# Altium project BTM_MAIN_UNIT.PrjPcb (part 3 of 3)

## Sheet 12V_TO_5V_DC.SchDoc
size A; SheetNumber: 28; SheetTotal: 28
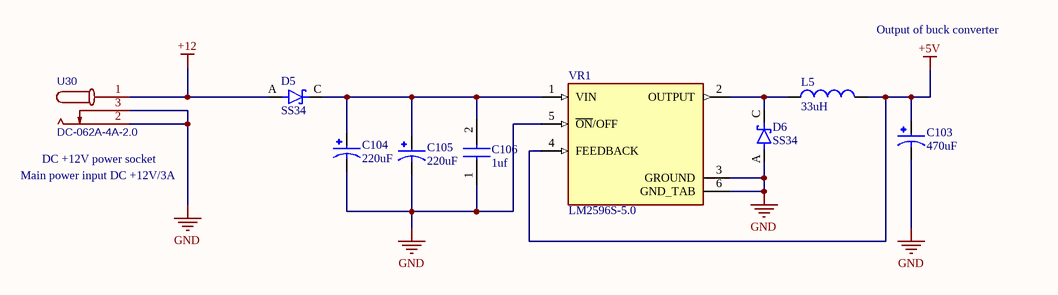
[diagram p28: 12V_TO_5V_DC.SchDoc]

### Parts
C103  470uF  [Plugin,6.3x8mm]
C104  220uF  [Plugin,6.3x8mm]
C105  220uF  [Plugin,6.3x8mm]
C106  1uf  [C0805]
D5  SS34  [SMA]
D6  SS34  [SMA]
L5  33uH  [Inductor]
U30  DC-062A-4A-2.0  [Plugin]
VR1  LM2596S-5.0  [TO-263-5]

### Nets
+5V: C103.1 L5.2 VR1.4(FEEDBACK)  [project net VBUS2]
+12: D5.A U30.1
GND: C103.2 C104.2 C105.2 C106.1(C1) D6.A U30.2 U30.3 VR1.3(GROUND) VR1.5(~{ON}/OFF) VR1.6(GND_TAB)
NetC104_1: C104.1 C105.1 C106.2(C2) D5.C(K) VR1.1(VIN)
NetD6_C: D6.C(K) L5.1 VR1.2(OUTPUT)

### Notes on the sheet
- Output of buck converter
- (near U30) Main power input DC +12V/3A
- (near U30) DC +12V power socket

### Library data of the parts
C103 = SPTOJM471E08OR: 6.3V 470uF ±20% Plugin,6.3x8mm Solid Capacitors ROHS; MPN: EEE-HC1H101P; Manufacturer: Panasonic; Package Reference: RADIAL-2 Panasonic; Value: *
C104 C105 = SPZ1CM221E08O00RAXXX: 16V 220uF ±20% 20mΩ@100kHz 2.7A@100kHz Plugin,6.3x8mm Solid Capacitors ROHS; MPN: EEE-HC1H101P; Manufacturer: Panasonic; Package Reference: RADIAL-2 Panasonic; Value: *
C106 = CL21B105KBFNNNE: 50V 1uF X7R ±10% 0805 Multilayer Ceramic Capacitors MLCC - SMD/SMT ROHS; Manufacturer: KEMET; MPN: CC0603JRNPO9BN180
D5 D6 = SS34: Diode Schottky 40V 3A 2-Pin SMC T/R; Value: *
  D5: Price: None; MP: SS34; Availability: Unavailable; Package: None
  D6: MPN: SS34; Package Reference: None
L5 = SLH1207S330MTT: 3A 33uH ±20% 64.8mΩ SMD Power Inductors ROHS; MPN: AIML-0805HC-100M-T; Manufacturer: Abracon; Package Reference: 2012 Abracon; Value: *
VR1 = LM2596S-5.0: Step-down type Fixed 40V~40V 5V 3A TO-263-5 DC-DC Converters ROHS; Value: *; Package Reference: None; MPN: LM2596S-5.0
U30 = DC-062A-4A-2.0: LCSC: C5147479; MPN: DC-062A-4A-2.0

## Sheet Display_PWR_CTRL.SchDoc
size A; SheetNumber: 21; SheetTotal: 30
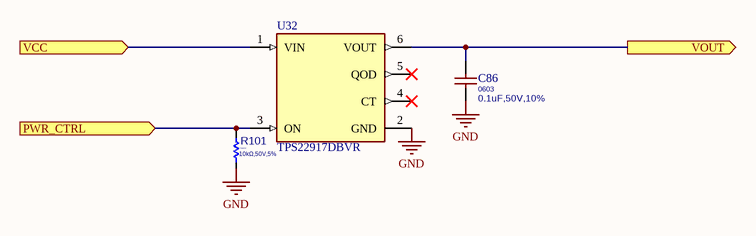
[diagram p29: Display_PWR_CTRL.SchDoc]

### Parts
C86  Package: 0603  [C0603]  (hidden comment: 0.1uF,50V,10%)
R101  value 10kΩ,50V,5%  Package: 0402  [R0402]  (hidden comment: 10kΩ)
U32  TPS22917DBVR  [SOT95P280X145-6N]

### Ports
PWR_CTRL (in), VCC (in), VOUT (out)

### Nets
GND: C86.1 R101.1 U32.2(GND)
NetC86_2: C86.2 U32.6(VOUT) ; port VOUT
NetR101_2: R101.2 U32.3(ON) ; port PWR_CTRL
NetU32_1: U32.1(VIN) ; port VCC

Not connected (* = marked no-connect by the designer): U32 4(CT)* 5(QOD)*

### Library data of the parts
C86 = GCM188R71H104KA57J: CAP CER 0.1UF 50V X7R 0603; Manufacturer: Murata Electronics; Type: SM; Min Operating Temp: -55°C; Max Operating Temp: 125°C; MPN: GCM188R71H104KA57J; Datasheet: https://datasheet.lcsc.com/lcsc/2404081050_Murata-Electronics-GCM188R71H104KA57J_C3011652.pdf; LCSC: C3011652; Value: 0.1uF,50V,10%
R101 = RC0402JR-0710KL: as R31-R33 on sheet ETHERNET_STM32; MPN: RC0402JR-0710KL; Max Operating Temp: +155; Min Operating Temp: -55; Datasheet: https://datasheet.lcsc.com/lcsc/1810241334_YAGEO-RC0402JR-0710KL_C60489.pdf; LCSC: C60489
U32 = TPS22917DBVR: 5.5-V, 2-A, 80-mÎ© , 10-nA leakage load switch adj. rise time and adj output discharge; MF: Texas Instruments; SnapEDA_Link: https://www.snapeda.com/parts/TPS22917DBVR/Texas+Instruments/view-part/?ref=snap; Package: SOT-23-6 Texas Instruments; Value: *; MP: TPS22917DBVR; Check_prices: https://www.snapeda.com/parts/TPS22917DBVR/Texas+Instruments/view-part/?ref=eda

## Nets that join several sheets
3V3: ETHERNET_STM32 (U4.1), NRF52 (9 pins)
+3.3V: Hierarchical schematics design (D3.C D7.C), MAX31865ATP (16 pins), BQ24259RGER (7 pins), SD card (7 pins), INPUT (R55.2 R56.2), STM32F446RET6 (16 pins), SIM7600G-H (U21.7), ESP8266 MODULE (R99.2 R100.2 U31.2), Humidity (R104.2), USER_INTERFACE_input (J3.9), BATTERY SOC (U25.3), ESP8266_PWR_CTRL (U33.1), ETHERNET_STM32 (7 pins)
+3.3V_LDO: Hierarchical schematics design (D3.A), 5v to 3.3V LDO (C101.1 U28.5)
+4.2V: PWR_CTRL (C48.2 U13.6), 3.4_4.2V_TO_FIXED_3.3V (C36.2 R59.2 U10.5), BUZZER (U34.1), SIM7600G-H_PWR_CTRL (U29.1), BOOST_CONVERTER (B1.5 C31.2 L6.1)
+12V: INPUT (U9.1), BOOST_CONVERTER (5 pins)
BAT: PWR_CTRL (C47.2 U12.6 U13.1), BQ24259RGER (5 pins)
GND: MAX31865ATP (24 pins), PWR_CTRL (6 pins), BQ24259RGER (16 pins), SD card (6 pins), POWER SUPPLY (C32.2 C33.1 D1.2 T1.6), INPUT (9 pins), STM32F446RET6 (28 pins), USB (7 pins), 3.4_4.2V_TO_FIXED_3.3V (7 pins), SIM7600G-H (63 pins), SIM_INTERFACE (10 pins), BUZZER (C111.1 LS1.N R83.1 U34.2), ESP8266 MODULE (U24.1 U31.4), Humidity (C87.1 C88.1 U26.5), USER_INTERFACE_input (J3.1), SIM7600G-H_PWR_CTRL (C102.1 R108.1 U29.2), BATTERY SOC (5 pins), ESP8266_PWR_CTRL (C107.1 R102.1 U33.2), BOOST_CONVERTER (6 pins), 5v to 3.3V LDO (C100.2 C101.2 U28.2), FLASH MEMORY (C2.1 U1.4), ETHERNET_W5500 (38 pins), ETHERNET_STM32 (11 pins), RS485 (1.5 R54.1 U6.2), SIM7600G-H_USB (8 pins), NRF52 (18 pins), 12V_TO_5V_DC (10 pins), Display_PWR_CTRL (C86.1 R101.1 U32.2)
USIM_VDD: SIM7600G-H (U22.20), SIM_INTERFACE (C81.2 CR1.1 J8.1)
VBAT: SIM7600G-H (9 pins), SIM7600G-H_PWR_CTRL (FB3.1)
VBUS2: BQ24259RGER (C38.2 U11.1 U11.24), POWER SUPPLY (C32.1 C33.2 D1.1 T1.4), RS485 (5 pins), 12V_TO_5V_DC (C103.1 L5.2 VR1.4)
VUSB: USB (USB1.2 USB1.11), 5v to 3.3V LDO (C100.1 U28.1 U28.3)
BAT+: BQ24259RGER (C44.2 J2.1 U11.13 U11.14), BATTERY SOC (C85.2 U25.2)
BOOST_COV_ON/OFF: STM32F446RET6 (U20.57), BOOST_CONVERTER (B1.4 R82.1)
BUTTON_1: STM32F446RET6 (U20.53), USER_INTERFACE_input (J3.4)
BUTTON_2: STM32F446RET6 (U20.2), USER_INTERFACE_input (J3.5)
BUTTON_3: STM32F446RET6 (U20.55), USER_INTERFACE_input (J3.6)
BUTTON_4: STM32F446RET6 (U20.56), USER_INTERFACE_input (J3.7)
BUZZER: STM32F446RET6 (U20.20), BUZZER (R83.2 U34.3)
CHARGE_STATUS: BQ24259RGER (R60.1 U11.4), STM32F446RET6 (U20.14)
CS: STM32F446RET6 (U20.11), USER_INTERFACE_input (J3.14)
CS_1: MAX31865ATP (U15.13), STM32F446RET6 (U20.33)
CS_2: MAX31865ATP (U17.13), STM32F446RET6 (U20.34)
CS_3: MAX31865ATP (U18.13), STM32F446RET6 (U20.35)
CS_4: MAX31865ATP (U14.13), STM32F446RET6 (U20.36)
DI1_MCU: INPUT (R55.1 U8.4), STM32F446RET6 (U20.38)
DI2_MCU: INPUT (R56.1 U7.4), STM32F446RET6 (U20.37)
DISP_RESET: STM32F446RET6 (U20.62), USER_INTERFACE_input (J3.13)
ESP8266_PWR_CTRL: STM32F446RET6 (U20.52), ESP8266_PWR_CTRL (R102.2 U33.3)
ESP8266_VCC: ESP8266 MODULE (U24.8), ESP8266_PWR_CTRL (C107.2 U33.6)
ESP_RXD: STM32F446RET6 (U20.51), ESP8266 MODULE (U24.4 U31.6)
ESP_TXD: STM32F446RET6 (U20.25), ESP8266 MODULE (U24.5 U31.8)
I2C1_SCL: BQ24259RGER (R63.1 U11.5), STM32F446RET6 (U20.58), Humidity (U26.3), BATTERY SOC (U25.7)
I2C1_SDA: BQ24259RGER (R64.1 U11.6), STM32F446RET6 (U20.59), Humidity (U26.4), BATTERY SOC (U25.8)
LCD_BK_LIGHT: STM32F446RET6 (U20.50), USER_INTERFACE_input (J3.2)
LCD_MOSI: STM32F446RET6 (U20.9), USER_INTERFACE_input (J3.10)
LCD_RS: STM32F446RET6 (U20.61), USER_INTERFACE_input (J3.12)
LCD_SCLK: STM32F446RET6 (U20.29), USER_INTERFACE_input (J3.11)
MDM_PWR_RST: STM32F446RET6 (U20.10), SIM7600G-H_PWR_CTRL (R108.2 U29.3)
NET_LED: SIM7600G-H (U22.51), USER_INTERFACE_input (J3.15)
NetC34_2: Hierarchical schematics design (D7.A), 3.4_4.2V_TO_FIXED_3.3V (C34.2 C35.2 U10.1 U10.10)
NetR86_1: STM32F446RET6 (U20.41), SIM7600G-H (R86.1)
NetU20_42: STM32F446RET6 (U20.42), SIM7600G-H (U21.1)
NetU20_43: STM32F446RET6 (U20.43), SIM7600G-H (U21.8)
OUTPUT1: INPUT (R72.1), STM32F446RET6 (U20.26)
OUTPUT2: INPUT (R73.1), STM32F446RET6 (U20.27)
PG_STATUS: BQ24259RGER (R61.1 U11.3), STM32F446RET6 (U20.15)
RGB_B: STM32F446RET6 (U20.17), USER_INTERFACE_input (J3.18)
RGB_G: STM32F446RET6 (U20.16), USER_INTERFACE_input (J3.17)
RGB_R: STM32F446RET6 (U20.24), USER_INTERFACE_input (J3.16)
RTD_CLK1: MAX31865ATP (U14.12 U15.12 U17.12 U18.12), STM32F446RET6 (U20.21)
RTD_MISO1: MAX31865ATP (U14.14 U15.14 U17.14 U18.14), STM32F446RET6 (U20.22)
RTD_MOSI1: MAX31865ATP (U14.11 U15.11 U17.11 U18.11), STM32F446RET6 (U20.23)
SD_CARD_DETECT: SD card (R6.1), STM32F446RET6 (U20.40)
SDIO_CLK: SD card (TF1.5), STM32F446RET6 (U20.28)
SDIO_CMD: SD card (R5.1 TF1.3), STM32F446RET6 (U20.54)
SDIO_D0: SD card (R4.1 TF1.7), STM32F446RET6 (U20.39)
USB1_D_N: STM32F446RET6 (U20.45), USB (U2.6)
USB1_D_P: STM32F446RET6 (U20.44), USB (U2.4)
USIM_CLK: SIM7600G-H (U22.19), SIM_INTERFACE (R91.2)
USIM_DATA: SIM7600G-H (U22.17), SIM_INTERFACE (R92.2)
USIM_RST: SIM7600G-H (U22.18), SIM_INTERFACE (R90.2)
Warning_LED: STM32F446RET6 (U20.8), USER_INTERFACE_input (J3.3)